# Altium schematic sheet Main.SchDoc: Main
size A4
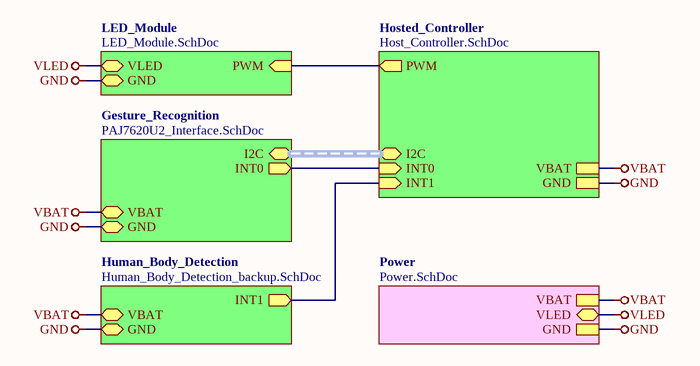
[diagram p0: Main.SchDoc]

## Sub-sheets
Gesture_Recognition = PAJ7620U2_Interface.SchDoc: VBAT, GND, INT0 (out), I2C (harness I2C)
Hosted_Controller = Host_Controller.SchDoc: VBAT, GND, PWM (out), I2C (harness I2C), INT0 (in), INT1 (in)
Human_Body_Detection = Human_Body_Detection_backup.SchDoc: INT1 (out), VBAT, GND
LED_Module = LED_Module.SchDoc: PWM (in), VLED, GND
Power = Power.SchDoc: VBAT, GND, VLED

## Nets
GND: sheet Power/GND, sheet Hosted_Controller/GND, sheet LED_Module/GND, sheet Gesture_Recognition/GND, sheet Human_Body_Detection/GND
VBAT: sheet Power/VBAT, sheet Hosted_Controller/VBAT, sheet Gesture_Recognition/VBAT, sheet Human_Body_Detection/VBAT
VLED: sheet Power/VLED, sheet LED_Module/VLED
(unnamed): sheet Hosted_Controller/PWM, sheet LED_Module/PWM
(unnamed): sheet Hosted_Controller/INT0, sheet Gesture_Recognition/INT0
(unnamed): sheet Hosted_Controller/INT1, sheet Human_Body_Detection/INT1

## Buses and harness runs
harness sheet Gesture_Recognition/I2C = sheet Hosted_Controller/I2C